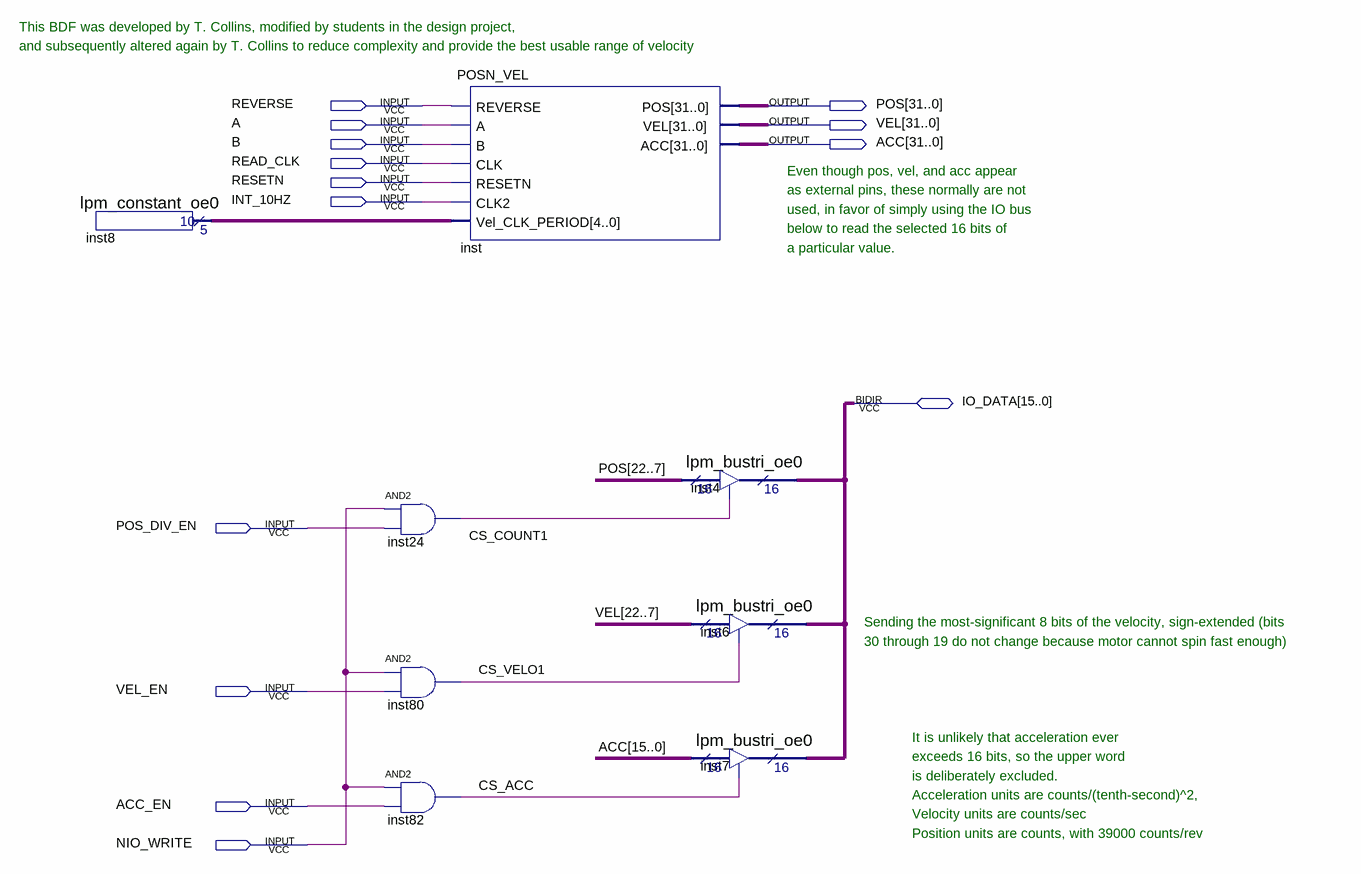
[diagram p0: schematic sheet]
// Quartus schematic OPTICAL_ENCODER.bdf as structural Verilog: 8 symbols, 14 pins
module OPTICAL_ENCODER (
  input  REVERSE,
  input  A,
  input  B,
  input  READ_CLK,
  input  RESETN,
  input  INT_10HZ,
  input  POS_DIV_EN,
  input  VEL_EN,
  input  ACC_EN,
  input  NIO_WRITE,
  inout  [15:0] IO_DATA,
  output [31:0] POS,
  output [31:0] VEL,
  output [31:0] ACC
);

  wire CS_ACC, CS_COUNT1, CS_VELO1;
  wire [4:0] inst8_result;

  lpm_constant_oe0 inst8 (.result(inst8_result));
  and inst24 (CS_COUNT1, NIO_WRITE, POS_DIV_EN);
  and inst80 (CS_VELO1, NIO_WRITE, VEL_EN);
  and inst82 (CS_ACC, NIO_WRITE, ACC_EN);
  POSN_VEL inst (
    .REVERSE(REVERSE), .A(A), .B(B), .CLK(READ_CLK), .RESETN(RESETN), .CLK2(INT_10HZ),
    .Vel_CLK_PERIOD(inst8_result), .POS(POS), .VEL(VEL), .ACC(ACC));
  lpm_bustri_oe0 inst4 (.enabledt(CS_COUNT1), .data(POS[22:7]), .tridata(IO_DATA));
  lpm_bustri_oe0 inst6 (.enabledt(CS_VELO1), .data(VEL[22:7]), .tridata(IO_DATA));
  lpm_bustri_oe0 inst7 (.enabledt(CS_ACC), .data(ACC[15:0]), .tridata(IO_DATA));

  // Notes on the sheet:
  //   This BDF was developed by T. Collins, modified by students in the design project,
  //   and subsequently altered again by T. Collins to reduce complexity and provide the best usable range of velocity
  //   Even though pos, vel, and acc appear
  //   as external pins, these normally are not
  //   used, in favor of simply using the IO bus
  //   below to read the selected 16 bits of
  //   a particular value.
  //   Sending the most-significant 8 bits of the velocity, sign-extended (bits
  //   30 through 19 do not change because motor cannot spin fast enough)
  //   It is unlikely that acceleration ever
  //   exceeds 16 bits, so the upper word
  //   is deliberately excluded.
  //   Acceleration units are counts/(tenth-second)^2,
  //   Velocity units are counts/sec
  //   Position units are counts, with 39000 counts/rev
endmodule
